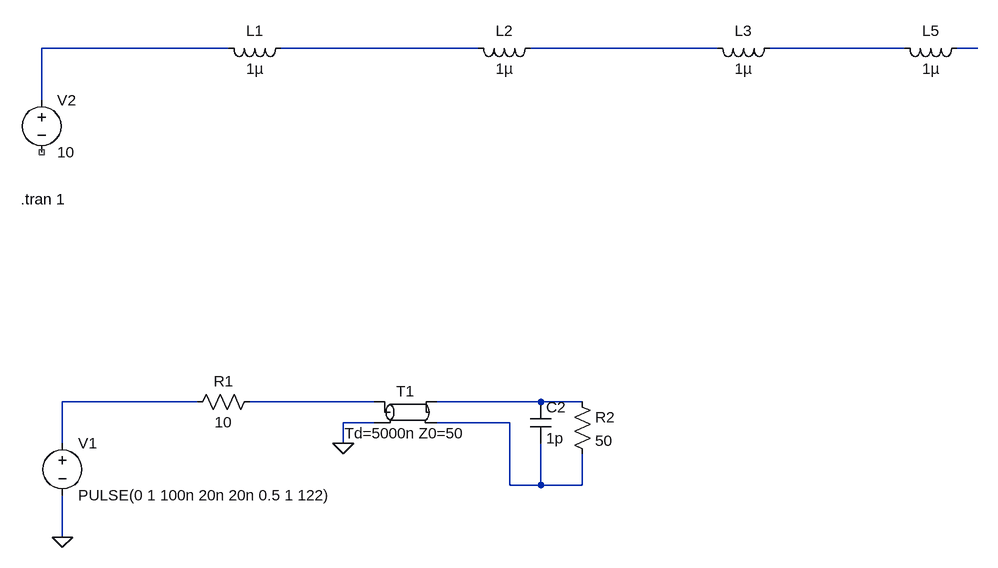
[diagram p0: schematic Delay tline testing.asc]
Delay tline testing.asc, the LTspice schematic file:
Version 4.1
SHEET 1 1348 900
WIRE 192 128 -96 128
WIRE 576 128 272 128
WIRE 944 128 656 128
WIRE 1232 128 1024 128
WIRE 1344 128 1312 128
WIRE -96 208 -96 128
WIRE 144 672 -64 672
WIRE 416 672 224 672
WIRE 672 672 512 672
WIRE 736 672 672 672
WIRE 416 704 368 704
WIRE 624 704 512 704
WIRE -64 736 -64 672
WIRE 368 736 368 704
WIRE 624 800 624 704
WIRE 672 800 672 736
WIRE 672 800 624 800
WIRE 736 800 736 752
WIRE 736 800 672 800
WIRE -64 880 -64 816
FLAG -64 880 0
FLAG 368 736 0
SYMBOL voltage -96 192 R0
WINDOW 123 0 0 Left 0
WINDOW 39 0 0 Left 0
SYMATTR InstName V2
SYMATTR Value 10
SYMBOL ind 288 112 R90
WINDOW 0 5 56 VBottom 2
WINDOW 3 32 56 VTop 2
SYMATTR InstName L1
SYMATTR Value 1µ
SYMBOL ind 672 112 R90
WINDOW 0 5 56 VBottom 2
WINDOW 3 32 56 VTop 2
SYMATTR InstName L2
SYMATTR Value 1µ
SYMBOL ind 1040 112 R90
WINDOW 0 5 56 VBottom 2
WINDOW 3 32 56 VTop 2
SYMATTR InstName L3
SYMATTR Value 1µ
SYMBOL ind 1328 112 R90
WINDOW 0 5 56 VBottom 2
WINDOW 3 32 56 VTop 2
SYMATTR InstName L5
SYMATTR Value 1µ
SYMBOL tline 464 688 R0
SYMATTR InstName T1
SYMATTR Value Td=5000n Z0=50
SYMBOL voltage -64 720 R0
WINDOW 123 0 0 Left 0
WINDOW 39 0 0 Left 0
SYMATTR InstName V1
SYMATTR Value PULSE(0 1 100n 20n 20n 0.5 1 122)
SYMBOL res 240 656 R90
WINDOW 0 0 56 VBottom 2
WINDOW 3 32 56 VTop 2
SYMATTR InstName R1
SYMATTR Value 10
SYMBOL res 720 656 R0
SYMATTR InstName R2
SYMATTR Value 50
SYMBOL cap 656 672 R0
SYMATTR InstName C2
SYMATTR Value 1p
TEXT -128 360 Left 2 !.tran 1

The netlist it stands for:
* Delay tline testing.asc
V2 N001 NC_01 10
L1 N002 N001 1µ
L2 N003 N002 1µ
L3 N004 N003 1µ
L5 N005 N004 1µ
T1 N007 0 N008 N009 Td=5000n Z0=50
V1 N006 0 PULSE(0 1 100n 20n 20n 0.5 1 122)
R1 N007 N006 10
R2 N008 N009 50
C2 N008 N009 1p
.tran 1
.backanno
.end